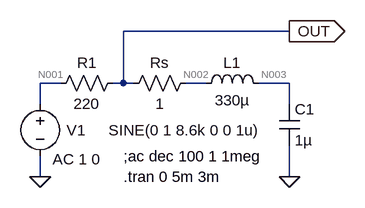
[diagram p0: schematic Inductometer.asc]
Inductometer.asc, the LTspice schematic file:
Version 4
SHEET 1 880 680
WIRE 416 16 160 16
WIRE 64 96 32 96
WIRE 160 96 160 16
WIRE 160 96 144 96
WIRE 176 96 160 96
WIRE 288 96 256 96
WIRE 416 96 368 96
WIRE 32 128 32 96
WIRE 416 128 416 96
WIRE 32 240 32 208
WIRE 416 240 416 192
FLAG 416 240 0
FLAG 32 240 0
FLAG 416 16 OUT
IOPIN 416 16 Out
SYMBOL ind 272 112 R270
WINDOW 0 32 56 VTop 2
WINDOW 3 5 56 VBottom 2
SYMATTR InstName L1
SYMATTR Value 330µ
SYMATTR SpiceLine Rser=0
SYMBOL cap 400 128 R0
SYMATTR InstName C1
SYMATTR Value 1µ
SYMBOL res 160 80 R90
WINDOW 0 0 56 VBottom 2
WINDOW 3 32 56 VTop 2
SYMATTR InstName R1
SYMATTR Value 220
SYMBOL voltage 32 112 R0
WINDOW 0 41 56 Left 2
WINDOW 3 105 56 Left 2
WINDOW 123 19 101 Left 2
WINDOW 39 0 0 Left 0
SYMATTR InstName V1
SYMATTR Value SINE(0 1 8.6k 0 0 1u)
SYMATTR Value2 AC 1 0
SYMBOL res 272 80 R90
WINDOW 0 0 56 VBottom 2
WINDOW 3 32 56 VTop 2
SYMATTR InstName Rs
SYMATTR Value 1
TEXT 160 208 Left 2 !;ac dec 100 1 1meg
TEXT 160 240 Left 2 !.tran 0 5m 3m

The netlist it stands for:
* Inductometer.asc
L1 N002 N003 330µ Rser=0
C1 N003 0 1µ
R1 OUT N001 220
V1 N001 0 SINE(0 1 8.6k 0 0 1u) AC 1 0
Rs N002 OUT 1
;ac dec 100 1 1meg
.tran 0 5m 3m
.backanno
.end

* Results of the author's LTspice run, read from the files saved beside the schematic
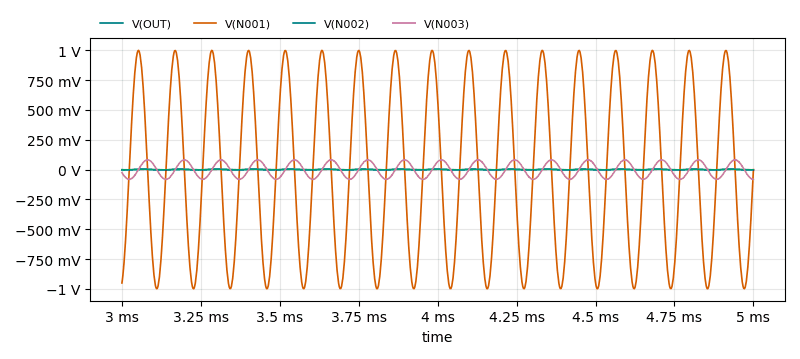
[diagram p1: Transient Analysis of Inductometer.asc, plotted from the saved traces]
* Transient Analysis, 1 run:
*   V(OUT): min -5.37 mV, max 5.049 mV, average -62 µV, rms 3.538 mV, last -2.499 mV
*   V(N001): min -999.8 mV, max 999.9 mV, average -6.371 mV, rms 707.3 mV, last 0 V
*   V(N002): min -2.51 mV, max 2.174 mV, average -33.62 µV, rms 1.562 mV, last -2.51 mV
*   V(N003): min -83.38 mV, max 81.84 mV, average -735.9 µV, rms 57.95 mV, last -83.38 mV